# EAGLE design Grove_IMU 9DOF (EAGLE 6.4)
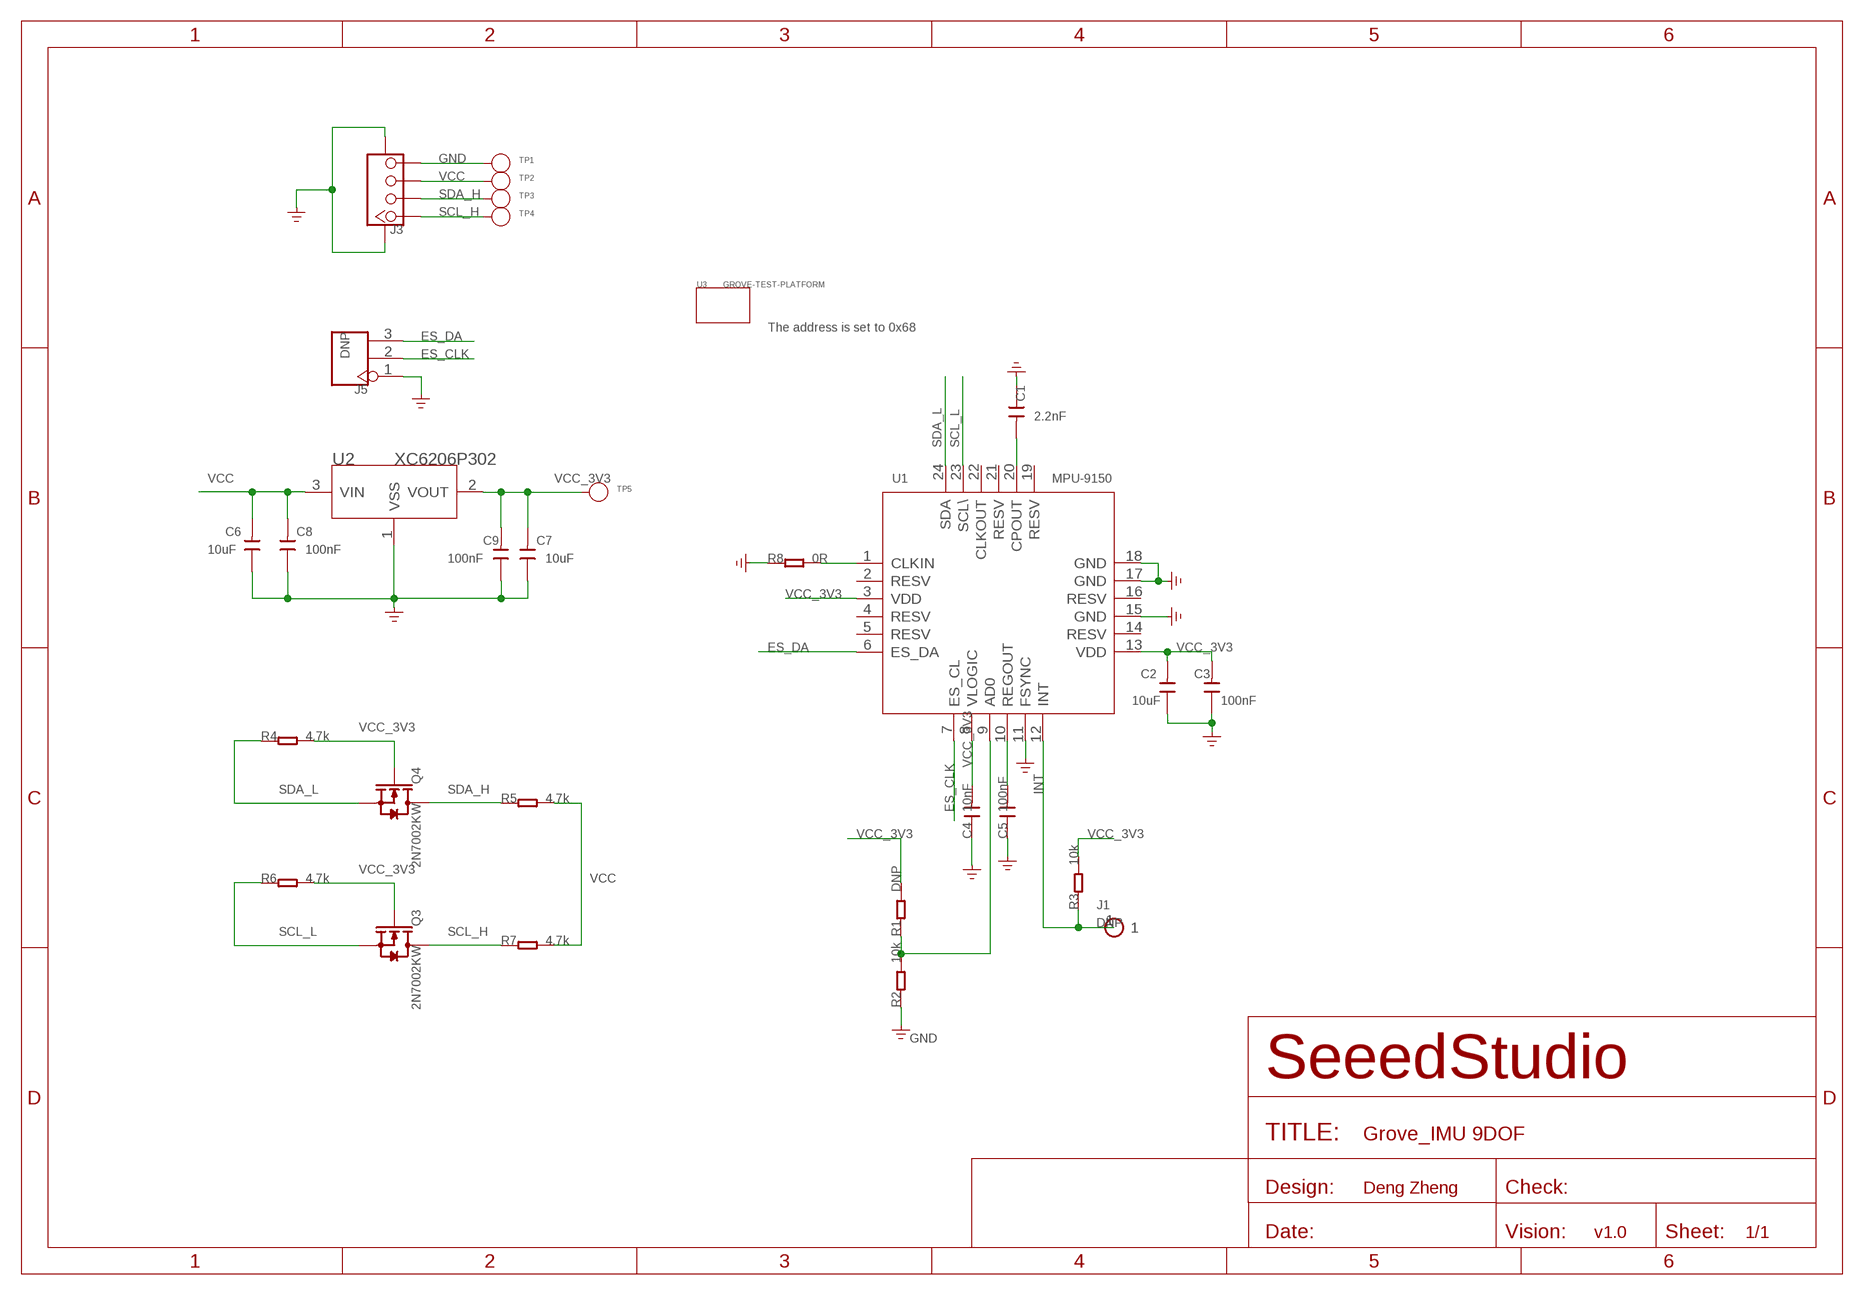
[diagram p0: schematic, sheet 1]

## Parts
C1  2.2nF  C-0603  [C0603]
C2  10uF  C-0805  [C0805]
C3  100nF  C-0603  [C0603]
C4  10nF  C-0603  [C0603]
C5  100nF  C-0603  [C0603]
C6  10uF  C-0805  [C0805]
C7  10uF  C-0805  [C0805]
C8  100nF  C-0603  [C0603]
C9  100nF  C-0603  [C0603]
J1  DNP  HEADER-1P-35  [1P-65/35MIL]
J3  TWIG-4P-2.0-SMD-FEMALE-REINFORCE'90D'  [4P-SMD-2.0-90D]
J5  DNP  HEADER-3P-2.54  [3P-2.54]
Q3  2N7002KW  MOSFET-N'SI1304BDL'  [SOT323]
Q4  2N7002KW  MOSFET-N'SI1304BDL'  [SOT323]
R1  DNP  R-0603  [R0603]
R2  10k  R-0603  [R0603]
R3  10k  R-0603  [R0603]
R4  4.7k  R-0603  [R0603]
R5  4.7k  R-0603  [R0603]
R6  4.7k  R-0603  [R0603]
R7  4.7k  R-0603  [R0603]
R8  0R  R-0603  [R0603]
TP1  PAD-TEST-POINT'4545'  [TP_4545]
TP2  PAD-TEST-POINT'4545'  [TP_4545]
TP3  PAD-TEST-POINT'4545'  [TP_4545]
TP4  PAD-TEST-POINT'4545'  [TP_4545]
TP5  PAD-TEST-POINT'4545'  [TP_4545]
U1  MPU-9150  [LGA-24]
U2  XC6206P302  XC6206MR  [SOT23]
U3  GROVE-TEST-PLATFORM  TWIG'2U'  [GROVE-TEST-PLATFORM]

## Nets
ES_CLK: J5.2 U1.7(ES_CL)
ES_DA: J5.3 U1.6(ES_DA)
GND: C1.1 C2.1 C3.1 C4.1 C5.1 C6.1 C7.1 C8.1 C9.1 J3.4 J3.SS1 J3.SS2 J5.1 R8.1 TP1.T U1.11(FSYNC) U1.15(GND) U1.17(GND) U1.18(GND) U2.1(VSS)
INT: J1.1 R3.1 U1.12(INT)
N$1: R1.1 R2.2 U1.9(AD0)
N$2: C1.2 U1.20(CPOUT)
N$4: R8.2 U1.1(CLKIN)
N$5: C5.2 U1.10(REGOUT)
SCL_H: J3.1 Q3.3(D) R7.1 TP4.T
SCL_L: Q3.2(S) R6.1 U1.23(SCL\)
SDA_H: J3.2 Q4.3(D) R5.1 TP3.T
SDA_L: Q4.2(S) R4.1 U1.24(SDA)
VCC: C6.2 C8.2 J3.3 R5.2 R7.2 TP2.T U2.3(VIN)
VCC_3V3: C2.2 C3.2 C4.2 C7.2 C9.2 Q3.1(G) Q4.1(G) R1.2 R3.2 R4.2 R6.2 TP5.T U1.3(VDD) U1.8(VLOGIC) U1.13(VDD) U2.2(VOUT)
Unconnected: R2.1 U1.2(RESV) U1.4(RESV) U1.5(RESV) U1.14(RESV) U1.16(RESV) U1.19(RESV) U1.21(RESV) U1.22(CLKOUT)

## Notes on the sheet
- The address is set to 0x68
- Deng Zheng
- v1.0

## Library data of the parts
C1-C9 = Discrete:C*: Ceramic Capacitors
J1 = Connector :HEADER-1P
J3 = Connector :TWIG-4P-2.0-SMD-FEMALE-REINFORCE
J5 = Connector :HEADER-3P
Q3 Q4 = Discrete:MOSFET-N: IRLL014: http://www.vishay.com/docs/91319/sihll014.pdf
R1-R8 = Discrete:R*
TP1-TP5 = Discrete:PAD-TEST-POINT; PARTNO: DNP
U1 = template:MPU-9150
U2 = IC:XC6206: LOW ESR Cap.Compatible Positive Voltage Regulators
U3 = template:TWIG

## Net classes
0 default: width 0.152 mm, drill 0.305 mm, clearance 0.152 mm
1 GND: width 0.152 mm, drill 0.305 mm, clearance 0.152 mm to class 0, clearance 0.152 mm

## Board
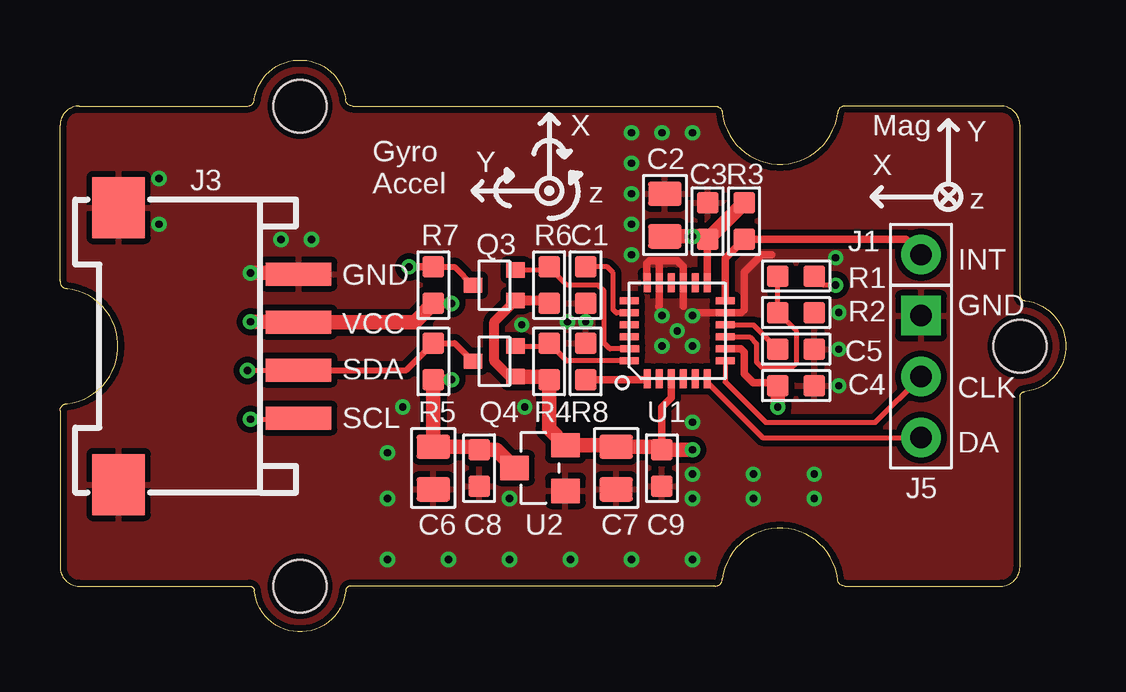
[diagram p1: board, top side]
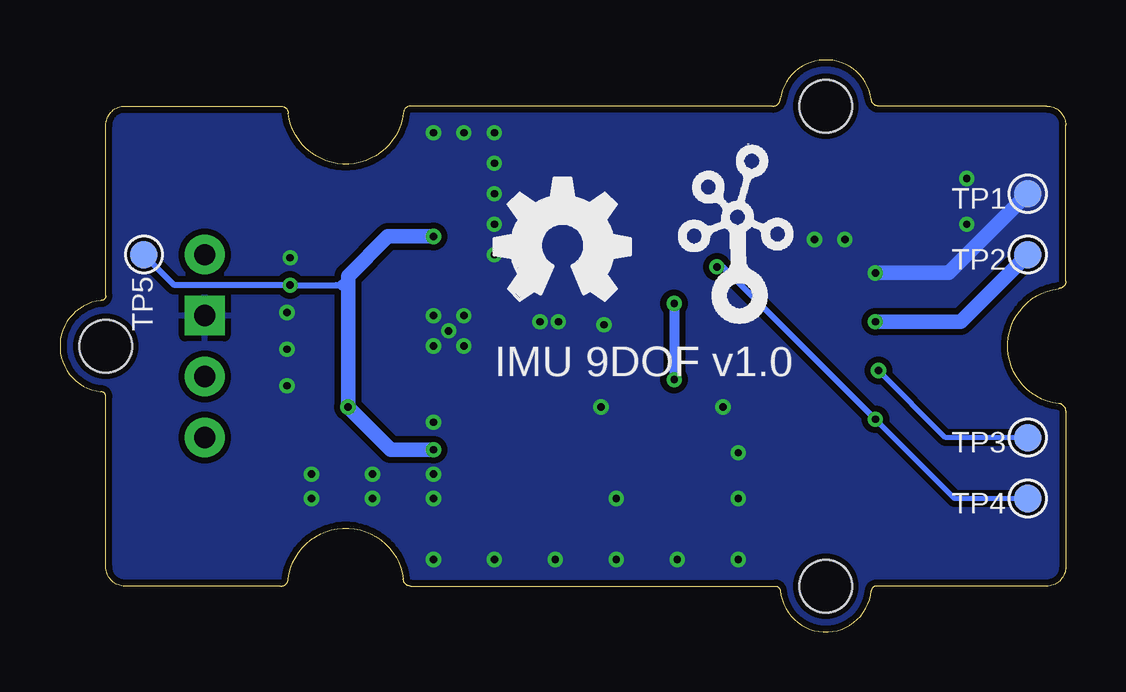
[diagram p2: board, bottom side, seen from below]

Size 41.91 x 23.83 mm. Coordinates in mm from the lower left corner, seen from the top.
Copper layers (1*16): Top 0.035mm / dielectric 1.5mm / Bottom 0.035mm
Design rules "SeeedStudio_rule_no_angle_090911 *": minimum track width 6mil, minimum drill 12mil, track to track 6mil, track to pad 6mil, pad to pad 6mil, via to via 6mil, smd to smd 0mil, copper to edge 10mil, drill to drill 10mil, minimum pad ring 10mil, minimum via ring 6mil, stop-mask expansion 2mil, vias tented up to drill 100mil, thermal gap 10mil
tRestrict: area 24.4,14.3 to 25,14.8

### Footprints (pad centres in the part's own frame; a part is rotated, then mirrored left to right if it is on the bottom)
C0603 = smd 0.889 x 0.889: 1 -0.762,0; 2 0.762,0
C0805 = smd 1.016 x 1.397: 1 -0.889,0; 2 0.889,0
1P-65/35MIL = drill 0.889 pad 1.651: 1 0,0
4P-SMD-2.0-90D = smd 0.965 x 2.74: 1 -3,-0.1; 2 -1,-0.1; 3 1,-0.1; 4 3,-0.1 | smd 2.54 x 2.184: SS1 -5.771,7.4; SS2 5.771,7.4
3P-2.54 = drill 0.889 pad 1.651 square: 1 0,2.54 | drill 0.889 pad 1.651: 2 0,0; 3 0,-2.54
SOT323 = smd 0.635 x 0.762: 1 -0.635,-0.889; 2 0.635,-0.889; 3 0,0.889
R0603 = smd 0.889 x 0.889: 1 -0.762,0; 2 0.762,0
TP_4545 = smd 1.143 x 1.143: T 0,0
LGA-24 = smd 0.8 x 0.3: 1 -2,1.25; 2 -2,0.75; 3 -2,0.25; 4 -2,-0.25; 5 -2,-0.75; 6 -2,-1.25; 13 2,-1.25; 14 2,-0.75; 15 2,-0.25; 16 2,0.25; 17 2,0.75; 18 2,1.25 | smd 0.3 x 0.8: 7 -1.25,-2; 8 -0.75,-2; 9 -0.25,-2; 10 0.25,-2; 11 0.75,-2; 12 1.25,-2; 19 1.25,2; 20 0.75,2; 21 0.25,2; 22 -0.25,2; 23 -0.75,1.975; 24 -1.25,2
SOT23 = smd 1.016 x 1.2: 1 -0.95,-1.06; 2 0.95,-1.06; 3 0,1.06
GROVE-TEST-PLATFORM = hole 2.2: -10,-10; -10,10; 20,0

### Placement (x,y rotation side)
C1  21.91,14.45 90 top
C2  25.21,17.37 270 top
C3  26.98,17.12 270 top
C4  30.67,10.26 180 top
C5  30.67,11.78 180 top
C6  15.55,6.83 90 top
C7  23.18,6.83 90 top
C8  17.46,6.83 90 top
C9  25.08,6.83 90 top
J1  35.88,15.72 90 top
J3  9.84,11.91 90 top
J5  35.88,10.64 0 top
Q3  18.09,14.45 90 top
Q4  18.09,11.27 90 top
R1  30.67,14.83 0 top
R2  30.67,13.31 180 top
R3  28.51,17.12 90 top
R4  20.38,11.27 270 top
R5  15.55,11.27 270 top
R6  20.38,14.45 270 top
R7  15.55,14.45 270 top
R8  21.91,11.27 270 top
TP1  1.59,18.26 0 bottom
TP2  1.59,15.72 0 bottom
TP3  1.59,8.1 0 bottom
TP4  1.59,5.56 0 bottom
TP5  38.41,15.72 0 bottom
U1  25.71,12.54 90 top
U2  20,6.83 90 top
U3  20,11.91 0 top
U$3  [OSHW_FILLX200_NOTEXT]  23.81,13.81 0 bottom
U$13  [TWIGLOGO]  13.65,13.81 0 bottom

### Tracks (layer width: path | path; a pad name or v marks a point on that pad's centre or on a via)
ES_CLK
  Top 0.203: U1.7 27.71,10.42 29.4,8.73 33.97,8.73 J5.2
ES_DA
  Top 0.203: J5.3 29.27,8.1 26.96,10.4 U1.6
GND  (via drill 0.3 pad 0.64)
  Top 0.305: 24.95,15.46 25.71,15.46 25.96,15.21 U1.15 25.96,13.56 25.97,13.56 | 24.95,15.46 24.57,15.46 24.45,15.34 24.45,14.56 U1.18 | 24.95,15.46 24.96,15.45 U1.17 24.96,13.57 24.95,13.56 | 29.65,15.72 29.25,15.72 28.51,14.98 28.51,13.43 28.37,13.29 U1.11 26.49,13.29 26.48,13.31
  Top 0.61: v7.94,14.96 9.89,14.96 J3.4
  Bottom 0.61: TP1.T 4.89,14.96 v7.94,14.96
  other vias: 21.91,12.92 21.14,12.92 19.24,12.8 13.65,5.56 18.73,5.56 13.65,7.46 14.29,9.37 19.36,9.37 13.65,3.02 16.19,3.02 18.73,3.02 21.27,3.02 23.81,3.02 26.35,3.02 26.35,5.56 23.81,15.72 23.81,16.99 23.81,18.26 32.45,13.31 26.35,8.73 23.81,19.53 26.35,20.8 23.81,20.8 25.08,20.8 25.71,12.54 25.08,13.18 26.35,13.18 25.08,11.91 26.35,11.91 32.45,11.78 32.45,10.26 31.43,6.57 28.89,6.57 26.35,6.57 28.89,5.56 32.32,15.59 31.43,5.56 9.21,16.35 10.47,16.35 4.12,16.99 4.12,18.89
  pour Bottom (isolate 0.254): -0.32,23.97 42.23,23.97 42.23,-0.16 -0.32,-0.16
  pour Top (isolate 0.254): -0.32,23.97 42.23,23.97 42.23,-0.16 -0.32,-0.16
INT
  Top 0.305: U1.12 27.71,15.56 R3.1 35.24,16.35 J1.1
N$1
  Top 0.203: U1.9 28.73,12.29 29.02,12.01 29.02,11.25 29.25,11.02 30.49,11.02 30.69,11.22 30.69,12.52 R2.2 R1.1
N$2
  Top 0.203: U1.20 23.19,13.29 23.05,13.43 23.05,14.96 22.79,15.21 C1.2
N$4
  Top 0.305: R8.2 24.43,10.51 U1.1
N$5
  Top 0.203: U1.10 28.89,12.79 C5.2
SCL_H  (via drill 0.3 pad 0.64)
  Top 0.203: v7.94,8.86 9.89,8.86 J3.1
  Top 0.254: R7.1 16.44,15.21 Q3.3
  Top 0.305: R7.1 v14.54,15.21
  Bottom 0.203: TP4.T 4.63,5.56 v7.94,8.86
  Bottom 0.254: v7.94,8.86 14.29,15.21 v14.54,15.21
SCL_L
  Top 0.203: U1.23 22.91,11.79 22.67,12.04 22.67,14.19 22.41,14.45 21.14,14.45 R6.1 20.25,15.08 Q3.2
SDA_H  (via drill 0.3 pad 0.64)
  Top 0.203: v7.81,10.89 9.92,10.89 J3.2
  Top 0.254: J3.2 14.43,10.91 R5.1 16.44,12.04 Q4.3
  Bottom 0.203: TP3.T 5.01,8.1 v7.81,10.89
SDA_L
  Top 0.203: Q4.2 20.25,11.91 R4.1 21.12,11.29 U1.24
VCC  (via drill 0.3 pad 0.64)
  Top 0.406: R7.2 v16.32,13.69 | v16.32,10.51 R5.2
  Top 0.61: R5.2 15.55,7.84 15.68,7.72 C6.2 17.33,7.72 C8.2 18.18,7.59 U2.3 | R7.2 14.78,12.91 J3.3 9.92,12.92 v7.94,12.92
  Bottom 0.406: v16.32,13.69 v16.32,10.51
  Bottom 0.61: TP2.T 4.38,12.92 v7.94,12.92
VCC_3V3  (via drill 0.3 pad 0.64)
  Top 0.203: v32.32,14.45 31.81,14.45 R1.2
  Top 0.305: C9.2 25.08,9.37 25.46,9.75 U1.3 | U1.13 26.96,16.33 C3.2 26.48,16.35 v26.35,16.48 | U1.8 28.37,11.79 28.51,11.65 28.51,10.77 28.89,10.38 29.78,10.38 C4.2
  Top 0.406: R6.2 20.25,13.81 Q3.1 18.09,12.92 18.09,11.27 18.73,10.64 Q4.1
  Top 0.61: C2.2 v26.35,16.48 26.86,16.48 C3.2 R3.2 | Q4.1 20.25,10.64 R4.2 20.38,8.46 U2.2 23.11,7.78 C7.2 24.95,7.72 C9.2 v26.35,7.59 | C4.2 v29.91,9.37
  Bottom 0.254: TP5.T 37.14,14.45 v32.32,14.45 30.41,14.45 30.29,14.45 | 30.29,14.45 30.03,14.45 29.91,14.58 | 30.29,14.45 30.03,14.7 | 30.29,14.45 30.03,14.19
  Bottom 0.61: v26.35,16.48 28.25,16.48 29.91,14.82 29.91,14.58 v29.91,9.37 28.13,7.59 v26.35,7.59

### Text on the board
tPlace: X | Mag | Y | Y | X | Gyro / Accel | z | z | GND | INT | VCC | GND | SDA | CLK | SCL | DA
bPlace: IMU 9DOF v1.0
tEnhance: Top Enhance 0.25~0.28mm
bEnhance: Bottom Enhance
bEnHoles: Holes on Bottom Enhance | All Holes are 70mil diameter